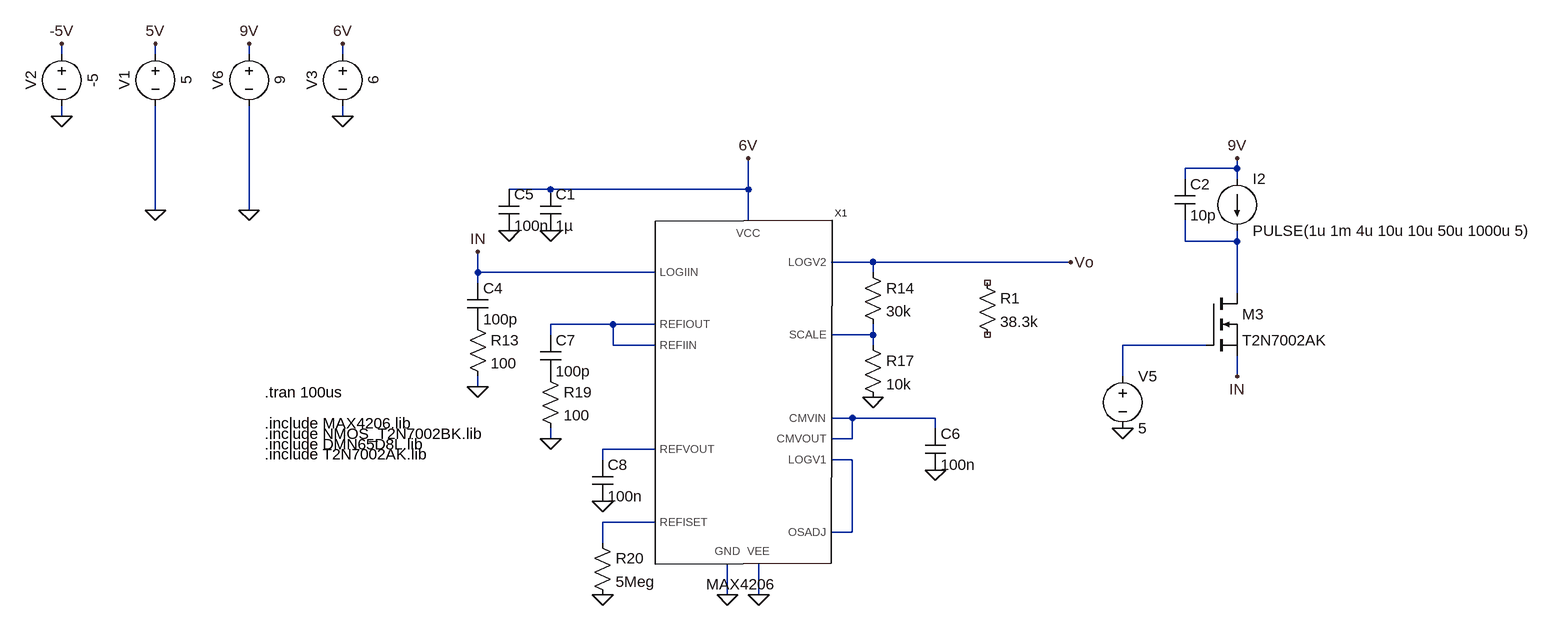
[diagram p0: schematic logTIA_MAX4206.asc]
logTIA_MAX4206.asc, the LTspice schematic file:
Version 4
SHEET 1 2052 1504
WIRE -2160 400 -2160 384
WIRE -2016 400 -2016 384
WIRE -1872 400 -1872 384
WIRE -1728 400 -1728 384
WIRE -2160 496 -2160 480
WIRE -1728 496 -1728 480
WIRE -352 576 -352 560
WIRE -352 576 -432 576
WIRE -432 592 -432 576
WIRE -352 592 -352 576
WIRE -1408 608 -1472 608
WIRE -1104 608 -1104 560
WIRE -1104 608 -1408 608
WIRE -2016 640 -2016 480
WIRE -1872 640 -1872 480
WIRE -1104 656 -1104 608
WIRE -432 688 -432 656
WIRE -352 688 -352 672
WIRE -352 688 -432 688
WIRE -912 720 -976 720
WIRE -608 720 -912 720
WIRE -1520 736 -1520 704
WIRE -1248 736 -1520 736
WIRE -912 736 -912 720
WIRE -1520 752 -1520 736
WIRE -352 768 -352 688
WIRE -1312 816 -1408 816
WIRE -1248 816 -1312 816
WIRE -1408 832 -1408 816
WIRE -912 832 -912 816
WIRE -912 832 -976 832
WIRE -1312 848 -1312 816
WIRE -1248 848 -1312 848
WIRE -912 848 -912 832
WIRE -400 848 -528 848
WIRE -528 896 -528 848
WIRE -352 896 -352 864
WIRE -1520 912 -1520 896
WIRE -944 960 -976 960
WIRE -816 960 -944 960
WIRE -816 976 -816 960
WIRE -1408 992 -1408 976
WIRE -944 992 -944 960
WIRE -944 992 -976 992
WIRE -1248 1008 -1328 1008
WIRE -1328 1024 -1328 1008
WIRE -944 1024 -976 1024
WIRE -1248 1120 -1328 1120
WIRE -944 1136 -944 1024
WIRE -944 1136 -976 1136
WIRE -1328 1152 -1328 1120
WIRE -1136 1232 -1136 1184
WIRE -1088 1232 -1088 1184
FLAG -1872 640 0
FLAG -1520 912 0
FLAG -1872 384 9V
FLAG -1472 672 0
FLAG -816 1040 0
FLAG -1408 992 0
FLAG -1328 1088 0
FLAG -1328 1232 0
FLAG -608 720 Vo
FLAG -1136 1232 0
FLAG -2016 640 0
FLAG -2016 384 5V
FLAG -2160 496 0
FLAG -2160 384 -5V
FLAG -912 928 0
FLAG -1088 1232 0
FLAG -352 560 9V
FLAG -1520 704 IN
FLAG -352 896 IN
FLAG -528 976 0
FLAG -1408 672 0
FLAG -1728 496 0
FLAG -1728 384 6V
FLAG -1104 560 6V
SYMBOL voltage -1872 384 R0
WINDOW 0 -32 56 VBottom 2
WINDOW 3 32 56 VTop 2
WINDOW 123 0 0 Left 0
WINDOW 39 0 0 Left 0
SYMATTR InstName V6
SYMATTR Value 9
SYMBOL cap -1536 752 R0
SYMATTR InstName C4
SYMATTR Value 100p
SYMBOL res -1536 800 R0
SYMATTR InstName R13
SYMATTR Value 100
SYMBOL cap -1488 608 R0
SYMATTR InstName C5
SYMATTR Value 100n
SYMBOL res -928 720 R0
SYMATTR InstName R14
SYMATTR Value 30k
SYMBOL res -928 832 R0
SYMATTR InstName R17
SYMATTR Value 10k
SYMBOL cap -832 976 R0
SYMATTR InstName C6
SYMATTR Value 100n
SYMBOL cap -1424 832 R0
SYMATTR InstName C7
SYMATTR Value 100p
SYMBOL res -1424 880 R0
SYMATTR InstName R19
SYMATTR Value 100
SYMBOL cap -1344 1024 R0
SYMATTR InstName C8
SYMATTR Value 100n
SYMBOL res -1344 1136 R0
SYMATTR InstName R20
SYMATTR Value 5Meg
SYMBOL voltage -2016 384 R0
WINDOW 0 -32 56 VBottom 2
WINDOW 3 32 56 VTop 2
WINDOW 123 0 0 Left 0
WINDOW 39 0 0 Left 0
SYMATTR InstName V1
SYMATTR Value 5
SYMBOL voltage -2160 384 R0
WINDOW 0 -32 56 VBottom 2
WINDOW 3 32 56 VTop 2
WINDOW 123 0 0 Left 0
WINDOW 39 0 0 Left 0
SYMATTR InstName V2
SYMATTR Value -5
SYMBOL nmos -400 768 R0
SYMATTR InstName M3
SYMATTR Value T2N7002AK
SYMATTR Prefix X
SYMBOL cap -448 592 R0
SYMATTR InstName C2
SYMATTR Value 10p
SYMBOL current -352 592 R0
WINDOW 123 0 0 Left 0
WINDOW 39 0 0 Left 0
SYMATTR InstName I2
SYMATTR Value PULSE(1u 1m 4u 10u 10u 50u 1000u 5)
SYMBOL voltage -528 880 R0
WINDOW 123 0 0 Left 0
WINDOW 39 0 0 Left 0
SYMATTR InstName V5
SYMATTR Value 5
SYMBOL MAX4206 -1232 768 R0
SYMATTR InstName X1
SYMATTR Prefix X
SYMBOL cap -1424 608 R0
SYMATTR InstName C1
SYMATTR Value 1µ
SYMBOL voltage -1728 384 R0
WINDOW 0 -32 56 VBottom 2
WINDOW 3 32 56 VTop 2
WINDOW 123 0 0 Left 0
WINDOW 39 0 0 Left 0
SYMATTR InstName V3
SYMATTR Value 6
SYMBOL res -752 736 R0
SYMATTR InstName R1
SYMATTR Value 38.3k
TEXT -1848 968 Left 2 !.include MAX4206.lib
TEXT -1848 920 Left 2 !.tran 100us
TEXT -1848 984 Left 2 !.include NMOS_T2N7002BK.lib
TEXT -1848 1000 Left 2 !.include DMN65D8L.lib
TEXT -1848 1016 Left 2 !.include T2N7002AK.lib

The netlist it stands for:
* logTIA_MAX4206.asc
V6 9V 0 9
C4 IN P001 100p
R13 P001 0 100
C5 6V 0 100n
R14 Vo N003 30k
R17 N003 0 10k
C6 N005 0 100n
C7 N002 P002 100p
R19 P002 0 100
C8 N006 0 100n
R20 N008 0 5Meg
V1 5V 0 5
V2 -5V 0 -5
XM3 N001 N004 IN T2N7002AK  ; pins D G S
C2 9V N001 10p
I2 9V N001 PULSE(1u 1m 4u 10u 10u 50u 1000u 5)
V5 N004 0 5
XX1 N006 0 0 N007 N007 N003 Vo 6V N008 N005 N002 N002 IN N005 MAX4206 params: MAX4206  ; pins REFVOUT GND VEE LOGV1 OSADJ SCALE LOGV2 VCC REFISET CMVOUT REFIOUT REFIIN LOGIIN CMVIN
C1 6V 0 1µ
V3 6V 0 6
R1 NC_01 NC_02 38.3k
.include MAX4206.lib
.tran 100us
.include NMOS_T2N7002BK.lib
.include DMN65D8L.lib
.include T2N7002AK.lib
.backanno
.end